# Altium schematic sheet Arduino Breakout.SchDoc: Arduino Leonardo Headers
size A; DrawnBy: Adam Vadala-Roth; DocumentNumber: 8; Revision: 2.4b; SheetNumber: 8; SheetTotal: 9
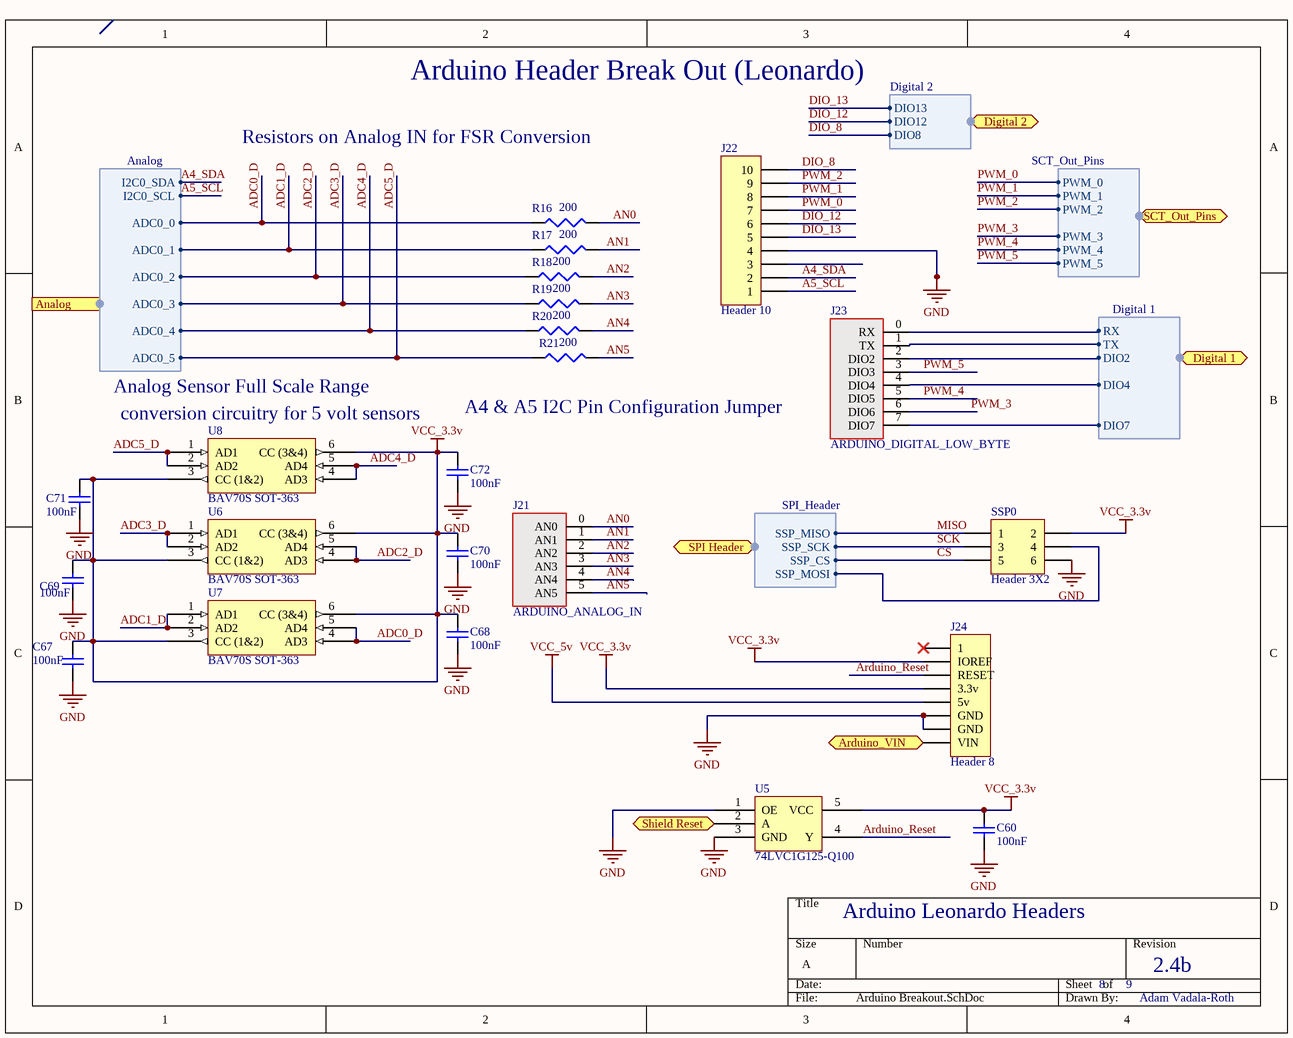
[diagram p0: Arduino Breakout.SchDoc]

## Parts
C60  value 100nF  [1608[0603]]  (hidden comment: Cap Semi)
C67  value 100nF  [1608[0603]]  (hidden comment: Cap Semi)
C68  value 100nF  [1608[0603]]  (hidden comment: Cap Semi)
C69  value 100nF  [1608[0603]]  (hidden comment: Cap Semi)
C70  value 100nF  [1608[0603]]  (hidden comment: Cap Semi)
C71  value 100nF  [1608[0603]]  (hidden comment: Cap Semi)
C72  value 100nF  [1608[0603]]  (hidden comment: Cap Semi)
J21  ARDUINO_ANALOG_IN  [HDR1X6]
J22  Header 10  [HDR1X10]
J23  ARDUINO_DIGITAL_LOW_BYTE  [HDR1X8]
J24  Header 8  [HDR1X8]
R16  value 200  [J1-0603]  (hidden comment: Res3)
R17  value 200  [J1-0603]  (hidden comment: Res3)
R18  value 200  [J1-0603]  (hidden comment: Res3)
R19  value 200  [J1-0603]  (hidden comment: Res3)
R20  value 200  [J1-0603]  (hidden comment: Res3)
R21  value 200  [J1-0603]  (hidden comment: Res3)
SSP0  Header 3X2  [HDR2X3]
U5  74LVC1G125-Q100  [74LVC1G125-Q100]
U6  BAV70S SOT-363  [BAV70S_SOT363]
U7  BAV70S SOT-363  [BAV70S_SOT363]
U8  BAV70S SOT-363  [BAV70S_SOT363]

## Ports
Analog (harness Analog), Arduino_VIN, Digital 1 (harness Digital 1), Digital 2 (harness Digital 2), SCT_Out_Pins (harness SCT_Out_Pins), Shield Reset, SPI Header (harness SPI_Header)

## Harnesses
Analog: ADC0_0, ADC0_1, ADC0_2, ADC0_3, ADC0_4, ADC0_5, I2C0_SCL, I2C0_SDA
Digital 1: TX, RX, DIO2, DIO4, DIO7
Digital 2: DIO8, DIO13, DIO12
SCT_Out_Pins: PWM_0, PWM_1, PWM_2, PWM_3, PWM_4, PWM_5
SPI_Header: SSP_CS, SSP_MOSI, SSP_MISO, SSP_SCK

## Nets
GND: C60.2 C67.2 C68.2 C69.2 C70.2 C71.2 C72.2 J22.4 J24.6(GND) J24.7(GND) SSP0.6 U5.1(OE) U5.3(GND)
VCC_3.3v: C60.1 C67.1 C68.1 C69.1 C70.1 C71.1 C72.1 J24.2(IOREF) J24.4(3.3v) SSP0.2 U5.5(VCC) U6.3(CC_(1&2)) U6.6(CC_(3&4)) U7.3(CC_(1&2)) U7.6(CC_(3&4)) U8.3(CC_(1&2)) U8.6(CC_(3&4))
VCC_5v: J24.5(5v)
A4_SDA: J22.2 ; port Analog.I2C0_SDA
A5_SCL: J22.1 ; port Analog.I2C0_SCL
ADC0_D: R16.1 U7.4(AD3) U7.5(AD4) ; port Analog.ADC0_0
ADC1_D: R17.1 U7.1(AD1) U7.2(AD2) ; port Analog.ADC0_1
ADC2_D: R18.1 U6.4(AD3) U6.5(AD4) ; port Analog.ADC0_2
ADC3_D: R19.1 U6.1(AD1) U6.2(AD2) ; port Analog.ADC0_3
ADC4_D: R20.1 U8.4(AD3) U8.5(AD4) ; port Analog.ADC0_4
ADC5_D: R21.1 U8.1(AD1) U8.2(AD2) ; port Analog.ADC0_5
AN0: J21.0(AN0) R16.2
AN1: J21.1(AN1) R17.2
AN2: J21.2(AN2) R18.2
AN3: J21.3(AN3) R19.2
AN4: J21.4(AN4) R20.2
AN5: J21.5(AN5) R21.2
Arduino_Reset: J24.3(RESET) U5.4(Y)
Arduino_VIN: J24.8(VIN) ; port Arduino_VIN
CS: SSP0.5 ; port SPI Header.SSP_CS
DIO_8: J22.10 ; port Digital 2.DIO8
DIO_12: J22.6 ; port Digital 2.DIO12
DIO_13: J22.5 ; port Digital 2.DIO13
MISO: SSP0.1 ; port SPI Header.SSP_MISO
PWM_0: J22.7 ; port SCT_Out_Pins.PWM_0
PWM_1: J22.8 ; port SCT_Out_Pins.PWM_1
PWM_2: J22.9 ; port SCT_Out_Pins.PWM_2
PWM_3: J23.6(DIO6) ; port SCT_Out_Pins.PWM_3
PWM_4: J23.5(DIO5) ; port SCT_Out_Pins.PWM_4
PWM_5: J23.3(DIO3) ; port SCT_Out_Pins.PWM_5
SCK: SSP0.3 ; port SPI Header.SSP_SCK
Shield Reset: U5.2(A) ; port Shield Reset
NetJ23_0: J23.0(RX) ; port Digital 1.RX
NetJ23_1: J23.1(TX) ; port Digital 1.TX
NetJ23_2: J23.2(DIO2) ; port Digital 1.DIO2
NetJ23_4: J23.4(DIO4) ; port Digital 1.DIO4
NetJ23_7: J23.7(DIO7) ; port Digital 1.DIO7
NetSSP0_4: SSP0.4 ; port SPI Header.SSP_MOSI

Not connected (* = marked no-connect by the designer): J22 3; J24 1*

## Notes on the sheet
- Arduino Header Break Out (Leonardo)
- Resistors on Analog IN for FSR Conversion
- Analog Sensor Full Scale Range
- conversion circuitry for 5 volt sensors
- A4 & A5 I2C Pin Configuration Jumper

## Library data of the parts
C60 C67-C72 = Cap Semi: Capacitor (Semiconductor SIM Model); Published: 8-Jun-2000; LatestRevisionDate: 29-May-2009; LatestRevisionNote: IPC-7351 Footprint Added.; PackageReference: C1206; Publisher: Altium Limited; PackageDescription: Chip Capacitor
J21 = ARDUINO_ANALOG_IN: 6-pin socket; pin to pad: 0>1 1>2 2>3 3>4 4>5 5>6
J22 = Header 10: Header, 10-Pin; LatestRevisionDate: 17-Jul-2002; LatestRevisionNote: Re-released for DXP Platform.; Publisher: Altium Limited
J23 = ARDUINO_DIGITAL_LOW_BYTE: 8-pin socket; pin to pad: 0>1 1>2 2>3 3>4 4>5 5>6 6>7 7>8
J24 = Header 8: Header, 8-Pin; LatestRevisionDate: 17-Jul-2002; LatestRevisionNote: Re-released for DXP Platform.; Publisher: Altium Limited
R16-R21 = Res3: Resistor; Published: 8-Jun-2000; LatestRevisionDate: 29-May-2009; LatestRevisionNote: IPC-7351 Footprint Added.; PackageReference: J1-0603; Publisher: Altium Limited; PackageDescription: Chip Resistor
SSP0 = Header 3X2: Header, 3-Pin, Dual row; LatestRevisionDate: 17-Jul-2002; LatestRevisionNote: Re-released for DXP Platform.; Publisher: Altium Limited